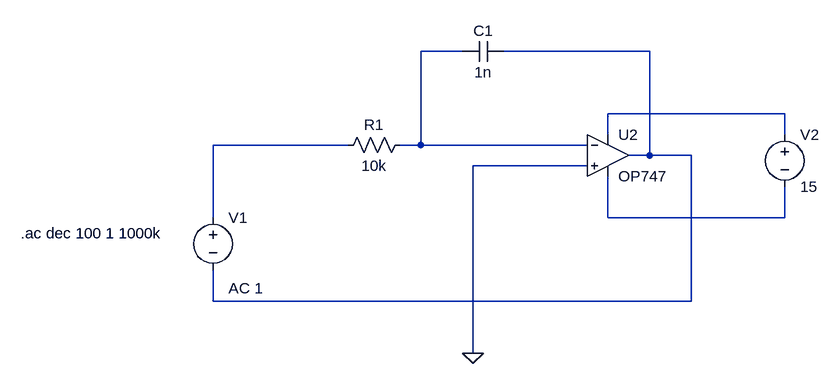
[diagram p0: schematic active_LowPass1.asc]
active_LowPass1.asc, the LTspice schematic file:
Version 4
SHEET 1 880 680
WIRE 144 16 80 16
WIRE 432 16 208 16
WIRE 640 112 368 112
WIRE 368 144 368 112
WIRE 640 144 640 112
WIRE -32 160 -240 160
WIRE 80 160 80 16
WIRE 80 160 48 160
WIRE 336 160 80 160
WIRE 432 176 432 16
WIRE 432 176 400 176
WIRE 496 176 432 176
WIRE 336 192 160 192
WIRE -240 272 -240 160
WIRE 368 272 368 208
WIRE 640 272 640 224
WIRE 640 272 368 272
WIRE -240 400 -240 352
WIRE 496 400 496 176
WIRE 496 400 -240 400
WIRE 160 480 160 192
FLAG 160 480 0
SYMBOL res 64 144 R90
WINDOW 0 0 56 VBottom 2
WINDOW 3 32 56 VTop 2
SYMATTR InstName R1
SYMATTR Value 10k
SYMBOL cap 208 0 R90
WINDOW 0 0 32 VBottom 2
WINDOW 3 32 32 VTop 2
SYMATTR InstName C1
SYMATTR Value 1n
SYMBOL voltage -240 256 R0
WINDOW 123 24 124 Left 2
WINDOW 39 0 0 Left 0
SYMATTR InstName V1
SYMATTR Value ""
SYMATTR Value2 AC 1
SYMBOL OpAmps\\OP747 368 112 R0
SYMATTR InstName U2
SYMBOL voltage 640 128 R0
WINDOW 123 0 0 Left 0
WINDOW 39 0 0 Left 0
SYMATTR InstName V2
SYMATTR Value 15
TEXT -536 296 Left 2 !.ac dec 100 1 1000k

The netlist it stands for:
* active_LowPass1.asc
R1 N001 N004 10k
C1 N002 N001 1n
V1 N004 N002 AC 1
XU2 0 N001 N003 N005 N002 OP747  ; pins In+ In- V+ V- OUT
V2 N003 N005 15
.ac dec 100 1 1000k
.backanno
.end